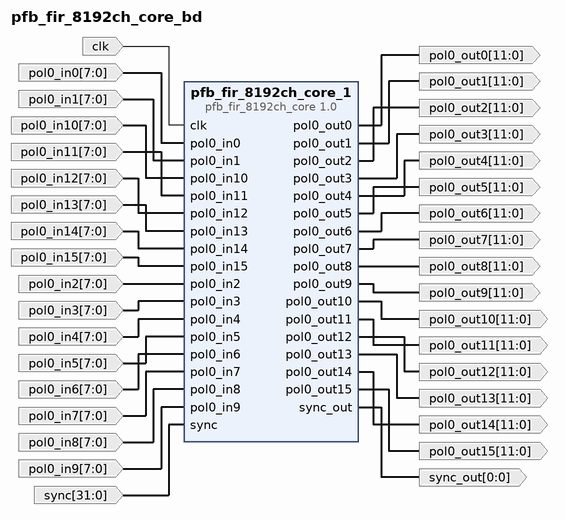
[diagram p0: block diagram of the top level]
# Vivado block design pfb_fir_8192ch_core_bd, xc7k325tfbg676-3, Vivado 2019.1
create_bd_design pfb_fir_8192ch_core_bd

create_bd_port -dir I -type clk clk
create_bd_port -dir I -from 7 -to 0 -type data pol0_in0
create_bd_port -dir I -from 7 -to 0 -type data pol0_in1
create_bd_port -dir I -from 7 -to 0 -type data pol0_in10
create_bd_port -dir I -from 7 -to 0 -type data pol0_in11
create_bd_port -dir I -from 7 -to 0 -type data pol0_in12
create_bd_port -dir I -from 7 -to 0 -type data pol0_in13
create_bd_port -dir I -from 7 -to 0 -type data pol0_in14
create_bd_port -dir I -from 7 -to 0 -type data pol0_in15
create_bd_port -dir I -from 7 -to 0 -type data pol0_in2
create_bd_port -dir I -from 7 -to 0 -type data pol0_in3
create_bd_port -dir I -from 7 -to 0 -type data pol0_in4
create_bd_port -dir I -from 7 -to 0 -type data pol0_in5
create_bd_port -dir I -from 7 -to 0 -type data pol0_in6
create_bd_port -dir I -from 7 -to 0 -type data pol0_in7
create_bd_port -dir I -from 7 -to 0 -type data pol0_in8
create_bd_port -dir I -from 7 -to 0 -type data pol0_in9
create_bd_port -dir O -from 11 -to 0 -type data pol0_out0
create_bd_port -dir O -from 11 -to 0 -type data pol0_out1
create_bd_port -dir O -from 11 -to 0 -type data pol0_out10
create_bd_port -dir O -from 11 -to 0 -type data pol0_out11
create_bd_port -dir O -from 11 -to 0 -type data pol0_out12
create_bd_port -dir O -from 11 -to 0 -type data pol0_out13
create_bd_port -dir O -from 11 -to 0 -type data pol0_out14
create_bd_port -dir O -from 11 -to 0 -type data pol0_out15
create_bd_port -dir O -from 11 -to 0 -type data pol0_out2
create_bd_port -dir O -from 11 -to 0 -type data pol0_out3
create_bd_port -dir O -from 11 -to 0 -type data pol0_out4
create_bd_port -dir O -from 11 -to 0 -type data pol0_out5
create_bd_port -dir O -from 11 -to 0 -type data pol0_out6
create_bd_port -dir O -from 11 -to 0 -type data pol0_out7
create_bd_port -dir O -from 11 -to 0 -type data pol0_out8
create_bd_port -dir O -from 11 -to 0 -type data pol0_out9
create_bd_port -dir I -from 31 -to 0 -type data sync
create_bd_port -dir O -from 0 -to 0 -type data sync_out

create_bd_cell -type ip -vlnv User_Company:SysGen:pfb_fir_8192ch_core:1.0 pfb_fir_8192ch_core_1

# ---- connections ----

connect_bd_net [get_bd_ports clk] [get_bd_pins pfb_fir_8192ch_core_1/clk]
connect_bd_net -net pol0_in0_1 [get_bd_ports pol0_in0] [get_bd_pins pfb_fir_8192ch_core_1/pol0_in0]
connect_bd_net -net pol0_in1_1 [get_bd_ports pol0_in1] [get_bd_pins pfb_fir_8192ch_core_1/pol0_in1]
connect_bd_net -net pol0_in10_1 [get_bd_ports pol0_in10] [get_bd_pins pfb_fir_8192ch_core_1/pol0_in10]
connect_bd_net -net pol0_in11_1 [get_bd_ports pol0_in11] [get_bd_pins pfb_fir_8192ch_core_1/pol0_in11]
connect_bd_net -net pol0_in12_1 [get_bd_ports pol0_in12] [get_bd_pins pfb_fir_8192ch_core_1/pol0_in12]
connect_bd_net -net pol0_in13_1 [get_bd_ports pol0_in13] [get_bd_pins pfb_fir_8192ch_core_1/pol0_in13]
connect_bd_net -net pol0_in14_1 [get_bd_ports pol0_in14] [get_bd_pins pfb_fir_8192ch_core_1/pol0_in14]
connect_bd_net -net pol0_in15_1 [get_bd_ports pol0_in15] [get_bd_pins pfb_fir_8192ch_core_1/pol0_in15]
connect_bd_net -net pol0_in2_1 [get_bd_ports pol0_in2] [get_bd_pins pfb_fir_8192ch_core_1/pol0_in2]
connect_bd_net -net pol0_in3_1 [get_bd_ports pol0_in3] [get_bd_pins pfb_fir_8192ch_core_1/pol0_in3]
connect_bd_net -net pol0_in4_1 [get_bd_ports pol0_in4] [get_bd_pins pfb_fir_8192ch_core_1/pol0_in4]
connect_bd_net -net pol0_in5_1 [get_bd_ports pol0_in5] [get_bd_pins pfb_fir_8192ch_core_1/pol0_in5]
connect_bd_net -net pol0_in6_1 [get_bd_ports pol0_in6] [get_bd_pins pfb_fir_8192ch_core_1/pol0_in6]
connect_bd_net -net pol0_in7_1 [get_bd_ports pol0_in7] [get_bd_pins pfb_fir_8192ch_core_1/pol0_in7]
connect_bd_net -net pol0_in8_1 [get_bd_ports pol0_in8] [get_bd_pins pfb_fir_8192ch_core_1/pol0_in8]
connect_bd_net -net pol0_in9_1 [get_bd_ports pol0_in9] [get_bd_pins pfb_fir_8192ch_core_1/pol0_in9]
connect_bd_net [get_bd_pins pfb_fir_8192ch_core_1/pol0_out0] [get_bd_ports pol0_out0]
connect_bd_net [get_bd_pins pfb_fir_8192ch_core_1/pol0_out1] [get_bd_ports pol0_out1]
connect_bd_net [get_bd_pins pfb_fir_8192ch_core_1/pol0_out10] [get_bd_ports pol0_out10]
connect_bd_net [get_bd_pins pfb_fir_8192ch_core_1/pol0_out11] [get_bd_ports pol0_out11]
connect_bd_net [get_bd_pins pfb_fir_8192ch_core_1/pol0_out12] [get_bd_ports pol0_out12]
connect_bd_net [get_bd_pins pfb_fir_8192ch_core_1/pol0_out13] [get_bd_ports pol0_out13]
connect_bd_net [get_bd_pins pfb_fir_8192ch_core_1/pol0_out14] [get_bd_ports pol0_out14]
connect_bd_net [get_bd_pins pfb_fir_8192ch_core_1/pol0_out15] [get_bd_ports pol0_out15]
connect_bd_net [get_bd_pins pfb_fir_8192ch_core_1/pol0_out2] [get_bd_ports pol0_out2]
connect_bd_net [get_bd_pins pfb_fir_8192ch_core_1/pol0_out3] [get_bd_ports pol0_out3]
connect_bd_net [get_bd_pins pfb_fir_8192ch_core_1/pol0_out4] [get_bd_ports pol0_out4]
connect_bd_net [get_bd_pins pfb_fir_8192ch_core_1/pol0_out5] [get_bd_ports pol0_out5]
connect_bd_net [get_bd_pins pfb_fir_8192ch_core_1/pol0_out6] [get_bd_ports pol0_out6]
connect_bd_net [get_bd_pins pfb_fir_8192ch_core_1/pol0_out7] [get_bd_ports pol0_out7]
connect_bd_net [get_bd_pins pfb_fir_8192ch_core_1/pol0_out8] [get_bd_ports pol0_out8]
connect_bd_net [get_bd_pins pfb_fir_8192ch_core_1/pol0_out9] [get_bd_ports pol0_out9]
connect_bd_net [get_bd_ports sync] [get_bd_pins pfb_fir_8192ch_core_1/sync]
connect_bd_net [get_bd_pins pfb_fir_8192ch_core_1/sync_out] [get_bd_ports sync_out]

validate_bd_design
save_bd_design
